# EAGLE design Mini_RGB (EAGLE 6.5.0)
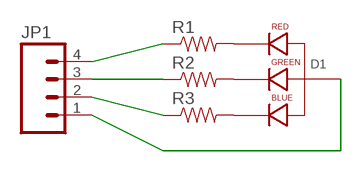
[diagram p0: schematic, sheet 1]

## Parts
D1  LED-RGB-CA-THRUDIFFUSE  [LED-RGB-THRU]
JP1  M04PTH  [1X04]
R1  RESISTORAXIAL-0.3  [AXIAL-0.3]
R2  RESISTORAXIAL-0.3  [AXIAL-0.3]
R3  RESISTORAXIAL-0.3  [AXIAL-0.3]

## Nets
B: JP1.2 R3.P$1
C: D1.2(ANODE) JP1.1
G: JP1.3 R2.P$1
N$4: D1.1(RED_CATHODE) R1.P$2
N$5: D1.3(GREEN_CATHODE) R2.P$2
N$6: D1.4(BLUE_CATHODE) R3.P$2
R: JP1.4 R1.P$1

## Library data of the parts
D1 = barbary_enterprises:LED-RGB-CA-THRU: RGB Through-hole common anode SparkFun store front COM-10821 (diffuse) COM-10820 (clear); PROD_ID: DIO-10632
JP1 = SparkFun-Connectors:M04: Header 4 Standard 4-pin 0.1" header. Use with straight break away headers (SKU : PRT-00116), right angle break away headers (PRT-00553), swiss pins (PRT-00743), machine pins (PRT-00117), and female headers (PRT-00115). Molex polarized connector foot print use with SKU : PRT-08231 with associated crimp pins and housings. 1MM SMD Version SKU: PRT-10208
R1-R3 = SparkFun-Resistors:RESISTOR: Resistor Basic schematic elements and footprints for 0603, 1206, and PTH resistors.

## Board
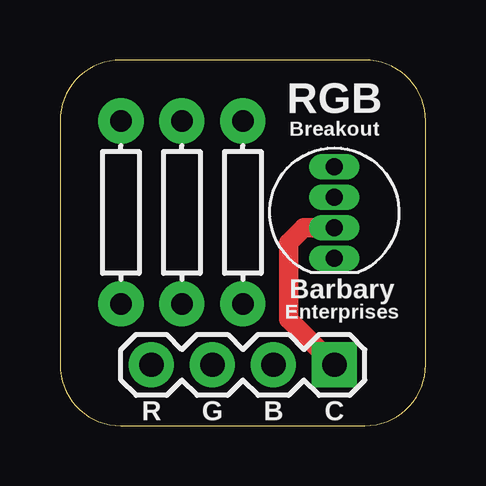
[diagram p1: board, top side]
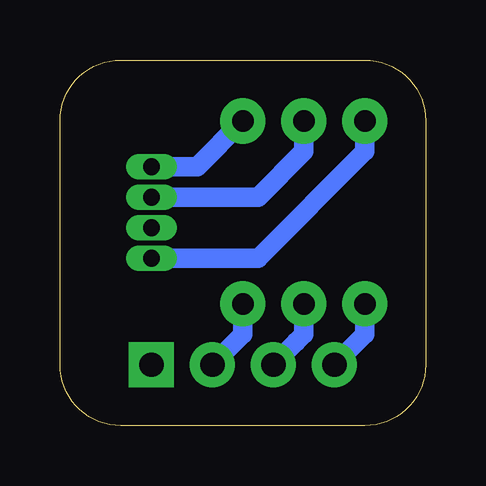
[diagram p2: board, bottom side, seen from below]

Size 15.24 x 15.24 mm. Coordinates in mm from the lower left corner, seen from the top.
Outline: 0,12.7 0,2.54 arc90 2.54,0 12.7,0 arc90 15.24,2.54 15.24,12.7 arc90 12.7,15.24 2.54,15.24 arc90 0,12.7
Copper layers (1*16): Top 0.0356mm / dielectric 1.5011mm / Bottom 0.0356mm
Design rules "LaenPCBOrder": minimum track width 6mil, minimum drill 13mil, track to track 6mil, track to pad 6mil, pad to pad 6mil, via to via 6mil, smd to smd 6mil, copper to edge 15mil, drill to drill 6mil, minimum pad ring 7mil, minimum via ring 7mil, stop-mask expansion 3mil, vias tented up to drill 0mil, thermal gap 10mil

### Footprints (pad centres in the part's own frame; a part is rotated, then mirrored left to right if it is on the bottom)
LED-RGB-THRU = drill 0.7 pad 0.813 long: 1 1.905,0; 2 0.635,0; 3 -0.635,0; 4 -1.905,0
1X04 = drill 1.016 pad 1.88 square: 1 0,0 | drill 1.016 pad 1.88: 2 2.54,0; 3 5.08,0; 4 7.62,0
AXIAL-0.3 = drill 0.9 pad 1.88: P$1 -3.81,0; P$2 3.81,0

### Placement (x,y rotation side)
D1  11.43,8.89 270 top
JP1  11.43,2.54 180 top
R1  2.54,8.89 90 top
R2  5.08,8.89 90 top
R3  7.62,8.89 90 top

### Tracks (layer width: path | path; a pad name or v marks a point on that pad's centre or on a via)
B
  Bottom 0.813: JP1.2 7.62,3.81 7.62,4.45 R3.P$1
C
  Top 0.813: JP1.1 9.53,4.45 9.53,7.62 10.16,8.26 D1.2
G
  Bottom 0.813: JP1.3 5.4,3.49 5.08,3.81 5.08,4.76 R2.P$1
N$4
  Bottom 0.813: D1.1 6.99,6.99 2.54,11.43 R1.P$2
N$5
  Bottom 0.813: D1.3 6.99,9.53 5.08,11.43 R2.P$2
N$6
  Bottom 0.813: D1.4 9.53,10.79 R3.P$2
R
  Bottom 0.813: JP1.4 2.54,3.81 R1.P$1

### Text on the board
tPlace: RGB | Breakout | Barbary | Enterprises | R | G | B | C